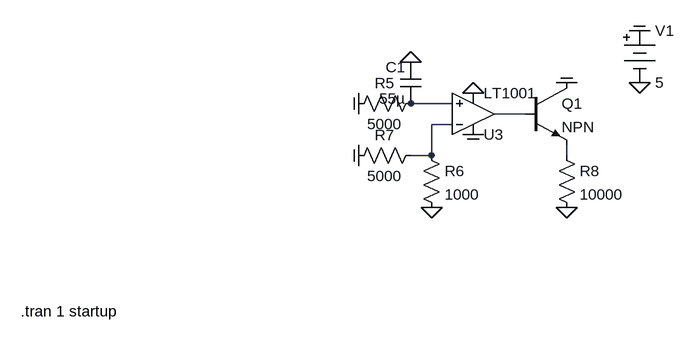
[diagram p0: schematic test2.asc]
test2.asc, the LTspice schematic file:
Version 4
SHEET 1 1144 680
WIRE 608 176 544 176
WIRE 720 192 672 192
WIRE 608 208 576 208
WIRE 576 256 576 208
WIRE 576 256 544 256
WIRE 784 256 784 240
FLAG 576 336 0
FLAG 464 256 COM
IOPIN 464 256 In
FLAG 896 144 0
FLAG 896 64 COM
IOPIN 896 64 Out
FLAG 784 144 COM
IOPIN 784 144 In
FLAG 784 336 0
FLAG 640 224 COM
IOPIN 640 224 Out
FLAG 640 160 0
FLAG 464 176 COM
IOPIN 464 176 In
FLAG 544 112 0
SYMBOL res 560 160 R90
WINDOW 0 0 56 VBottom 2
WINDOW 3 32 56 VTop 2
SYMATTR InstName R5
SYMATTR Value 5000
SYMBOL cap 560 176 R180
WINDOW 0 24 56 Left 2
WINDOW 3 24 8 Left 2
SYMATTR InstName C1
SYMATTR Value 55µ
SYMBOL OpAmps\\LT1001 640 256 M180
SYMATTR InstName U3
SYMBOL res 560 240 R0
SYMATTR InstName R6
SYMATTR Value 1000
SYMBOL res 560 240 R90
WINDOW 0 0 56 VBottom 2
WINDOW 3 32 56 VTop 2
SYMATTR InstName R7
SYMATTR Value 5000
SYMBOL Misc\\battery 896 48 R0
WINDOW 123 0 0 Left 0
WINDOW 39 0 0 Left 0
SYMATTR InstName V1
SYMATTR Value 5
SYMBOL npn 720 144 R0
SYMATTR InstName Q1
SYMBOL res 768 240 R0
SYMATTR InstName R8
SYMATTR Value 10000
TEXT -56 496 Left 2 !.tran 1 startup

The netlist it stands for:
* test2.asc
R5 N001 COM 5000
C1 N001 0 55µ
XU3 N001 N003 COM 0 N002 LT1001  ; pins In+ In- V+ V- OUT
R6 N003 0 1000
R7 N003 COM 5000
V1 COM 0 5
Q1 COM N002 N004 0 NPN
R8 N004 0 10000
.model NPN NPN
.model PNP PNP
.lib standard.bjt
.tran 1 startup
.lib LTC.lib
.backanno
.end